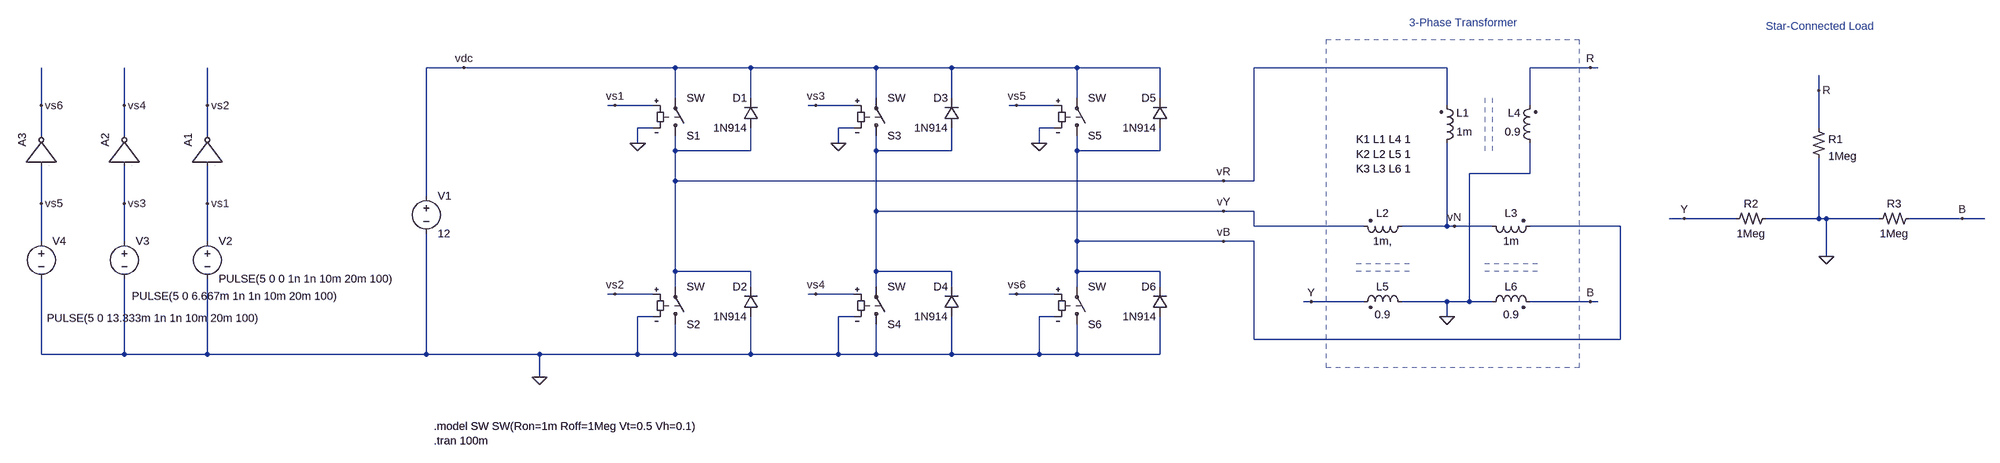
[diagram p0: schematic single-phase-inverter_v2p0.asc]
single-phase-inverter_v2p0.asc, the LTspice schematic file:
Version 4
SHEET 1 3380 860
WIRE -208 64 -288 64
WIRE 240 64 -208 64
WIRE 400 64 240 64
WIRE 704 64 400 64
WIRE 864 64 704 64
WIRE 1136 64 864 64
WIRE 1312 64 1136 64
WIRE 2032 64 1536 64
WIRE 2336 64 2208 64
WIRE 2352 64 2336 64
WIRE 2992 112 2992 80
WIRE 240 128 240 64
WIRE 400 128 400 64
WIRE 704 128 704 64
WIRE 864 128 864 64
WIRE 1136 128 1136 64
WIRE 1312 128 1312 64
WIRE -1104 144 -1104 64
WIRE -928 144 -928 64
WIRE -752 144 -752 64
WIRE 112 144 96 144
WIRE 192 144 112 144
WIRE 576 144 560 144
WIRE 656 144 576 144
WIRE 1008 144 992 144
WIRE 1088 144 1008 144
WIRE 2032 144 2032 64
WIRE 2208 144 2208 64
WIRE 192 192 160 192
WIRE 656 192 624 192
WIRE 1088 192 1056 192
WIRE 2992 192 2992 112
WIRE -1104 208 -1104 144
WIRE -928 208 -928 144
WIRE -752 208 -752 144
WIRE 160 224 160 192
WIRE 624 224 624 192
WIRE 1056 224 1056 192
WIRE 240 240 240 208
WIRE 400 240 400 192
WIRE 400 240 240 240
WIRE 704 240 704 208
WIRE 864 240 864 192
WIRE 864 240 704 240
WIRE 1136 240 1136 208
WIRE 1312 240 1312 192
WIRE 1312 240 1136 240
WIRE 2208 288 2208 224
WIRE 2208 288 2080 288
WIRE 240 304 240 240
WIRE 1472 304 240 304
WIRE 1536 304 1536 64
WIRE 1536 304 1472 304
WIRE -288 336 -288 64
WIRE -1104 352 -1104 272
WIRE -928 352 -928 272
WIRE -752 352 -752 272
WIRE 704 368 704 240
WIRE 1472 368 704 368
WIRE 1536 368 1472 368
WIRE 2672 384 2640 384
WIRE 2816 384 2672 384
WIRE 2992 384 2992 256
WIRE 2992 384 2880 384
WIRE 3008 384 2992 384
WIRE 3120 384 3008 384
WIRE 3296 384 3184 384
WIRE 3344 384 3296 384
WIRE 1536 400 1536 368
WIRE 1856 400 1536 400
WIRE 2032 400 2032 224
WIRE 2032 400 1936 400
WIRE 2048 400 2032 400
WIRE 2128 400 2048 400
WIRE 2400 400 2208 400
WIRE -1104 432 -1104 352
WIRE -928 432 -928 352
WIRE -752 432 -752 352
WIRE 1136 432 1136 240
WIRE 1472 432 1136 432
WIRE 1536 432 1472 432
WIRE 3008 464 3008 384
WIRE 240 496 240 304
WIRE 400 496 240 496
WIRE 704 496 704 368
WIRE 864 496 704 496
WIRE 1136 496 1136 432
WIRE 1312 496 1136 496
WIRE 240 528 240 496
WIRE 400 528 400 496
WIRE 704 528 704 496
WIRE 864 528 864 496
WIRE 1136 528 1136 496
WIRE 1312 528 1312 496
WIRE 112 544 96 544
WIRE 192 544 112 544
WIRE 576 544 560 544
WIRE 656 544 576 544
WIRE 1008 544 992 544
WIRE 1088 544 1008 544
WIRE 1744 560 1728 560
WIRE 1856 560 1744 560
WIRE 2032 560 1936 560
WIRE 2080 560 2080 288
WIRE 2080 560 2032 560
WIRE 2128 560 2080 560
WIRE 2336 560 2208 560
WIRE 2352 560 2336 560
WIRE 192 592 160 592
WIRE 656 592 624 592
WIRE 1088 592 1056 592
WIRE 2032 592 2032 560
WIRE 1536 640 1536 432
WIRE 2400 640 2400 400
WIRE 2400 640 1536 640
WIRE -1104 672 -1104 512
WIRE -928 672 -928 512
WIRE -928 672 -1104 672
WIRE -752 672 -752 512
WIRE -752 672 -928 672
WIRE -288 672 -288 416
WIRE -288 672 -752 672
WIRE -48 672 -288 672
WIRE 160 672 160 592
WIRE 160 672 -48 672
WIRE 240 672 240 608
WIRE 240 672 160 672
WIRE 400 672 400 592
WIRE 400 672 240 672
WIRE 624 672 624 592
WIRE 624 672 400 672
WIRE 704 672 704 608
WIRE 704 672 624 672
WIRE 864 672 864 592
WIRE 864 672 704 672
WIRE 1056 672 1056 592
WIRE 1056 672 864 672
WIRE 1136 672 1136 608
WIRE 1136 672 1056 672
WIRE 1312 672 1312 592
WIRE 1312 672 1136 672
WIRE -48 720 -48 672
FLAG 160 224 0
FLAG 624 224 0
FLAG 1056 224 0
FLAG -208 64 vdc
FLAG 112 144 vs1
FLAG 112 544 vs2
FLAG 576 144 vs3
FLAG 576 544 vs4
FLAG 1008 144 vs5
FLAG 1008 544 vs6
FLAG -752 352 vs1
FLAG -752 144 vs2
FLAG -928 352 vs3
FLAG -928 144 vs4
FLAG -1104 352 vs5
FLAG -1104 144 vs6
FLAG 1472 304 vR
FLAG 1472 368 vY
FLAG 1472 432 vB
FLAG -48 720 0
FLAG 2048 400 vN
FLAG 1744 560 Y
FLAG 2336 64 R
FLAG 2336 560 B
FLAG 3008 464 0
FLAG 2992 112 R
FLAG 2672 384 Y
FLAG 3296 384 B
FLAG 2032 592 0
SYMBOL sw 240 224 M180
SYMATTR InstName S1
SYMBOL sw 240 624 M180
SYMATTR InstName S2
SYMBOL sw 704 224 M180
SYMATTR InstName S3
SYMBOL sw 704 624 M180
SYMATTR InstName S4
SYMBOL sw 1136 224 M180
SYMATTR InstName S5
SYMBOL sw 1136 624 M180
SYMATTR InstName S6
SYMBOL voltage -288 320 R0
SYMATTR InstName V1
SYMATTR Value 12
SYMBOL voltage -752 416 R0
SYMATTR InstName V2
SYMATTR Value PULSE(5 0 0 1n 1n 10m 20m 100)
SYMBOL voltage -928 416 R0
WINDOW 3 16 132 Left 2
SYMATTR Value PULSE(5 0 6.667m 1n 1n 10m 20m 100)
SYMATTR InstName V3
SYMBOL voltage -1104 416 R0
WINDOW 3 12 179 Left 2
SYMATTR Value PULSE(5 0 13.333m 1n 1n 10m 20m 100)
SYMATTR InstName V4
SYMBOL diode 416 192 R180
WINDOW 0 24 64 Left 2
WINDOW 3 24 0 Left 2
SYMATTR InstName D1
SYMATTR Value 1N914
SYMBOL diode 416 592 R180
WINDOW 0 24 64 Left 2
WINDOW 3 24 0 Left 2
SYMATTR InstName D2
SYMATTR Value 1N914
SYMBOL diode 880 192 R180
WINDOW 0 24 64 Left 2
WINDOW 3 24 0 Left 2
SYMATTR InstName D3
SYMATTR Value 1N914
SYMBOL diode 880 592 R180
WINDOW 0 24 64 Left 2
WINDOW 3 24 0 Left 2
SYMATTR InstName D4
SYMATTR Value 1N914
SYMBOL diode 1328 192 R180
WINDOW 0 24 64 Left 2
WINDOW 3 24 0 Left 2
SYMATTR InstName D5
SYMATTR Value 1N914
SYMBOL diode 1328 592 R180
WINDOW 0 24 64 Left 2
WINDOW 3 24 0 Left 2
SYMATTR InstName D6
SYMATTR Value 1N914
SYMBOL Digital/inv -816 272 R270
SYMATTR InstName A1
SYMBOL Digital/inv -992 272 R270
SYMATTR InstName A2
SYMBOL Digital/inv -1168 272 R270
SYMATTR InstName A3
SYMATTR SpiceLine VHIGH=5
SYMBOL ind2 2016 240 M180
WINDOW 0 36 80 Left 2
WINDOW 3 36 40 Left 2
SYMATTR InstName L1
SYMATTR Value 1m
SYMATTR SpiceLine Rser=1m
SYMBOL ind2 1952 384 R90
WINDOW 0 4 56 VBottom 2
WINDOW 3 32 56 VTop 2
SYMATTR InstName L2
SYMATTR Value 1m,
SYMATTR SpiceLine Rser=1m
SYMBOL ind2 2112 384 M90
WINDOW 0 4 56 VBottom 2
WINDOW 3 32 56 VTop 2
SYMATTR InstName L3
SYMATTR Value 1m
SYMATTR SpiceLine Rser=1m
SYMBOL ind2 2224 240 R180
WINDOW 0 36 80 Left 2
WINDOW 3 36 40 Left 2
SYMATTR InstName L4
SYMATTR Value 0.9
SYMATTR SpiceLine Rser=1m
SYMBOL ind2 1952 576 M270
WINDOW 0 32 56 VTop 2
WINDOW 3 4 56 VBottom 2
SYMATTR InstName L5
SYMATTR Value 0.9
SYMATTR SpiceLine Rser=1m
SYMBOL ind2 2112 576 R270
WINDOW 0 32 56 VTop 2
WINDOW 3 4 56 VBottom 2
SYMATTR InstName L6
SYMATTR Value 0.9
SYMATTR SpiceLine Rser=1m
SYMBOL res2 2976 192 R0
SYMATTR InstName R1
SYMATTR Value 1Meg
SYMBOL res2 2816 400 R270
WINDOW 0 32 32 VTop 2
WINDOW 3 0 32 VBottom 2
SYMATTR InstName R2
SYMATTR Value 1Meg
SYMBOL res2 3184 368 R90
WINDOW 0 0 32 VBottom 2
WINDOW 3 32 32 VTop 2
SYMATTR InstName R3
SYMATTR Value 1Meg
TEXT -272 824 Left 2 !.model SW SW(Ron=1m Roff=1Meg Vt=0.5 Vh=0.1)\n.tran 100m
TEXT 1840 216 Left 2 !K1 L1 L4 1\nK2 L2 L5 1\nK3 L3 L6 1
TEXT 1952 -32 Left 2 ;3-Phase Transformer
TEXT 2880 -24 Left 2 ;Star-Connected Load
LINE Normal 2112 128 2112 240 2
LINE Normal 2128 128 2128 240 2
LINE Normal 2224 480 2112 480 2
LINE Normal 2224 496 2112 496 2
LINE Normal 1952 480 1840 480 2
LINE Normal 1952 496 1840 496 2
RECTANGLE Normal 1776 4 2312 700 2

The netlist it stands for:
* single-phase-inverter_v2p0.asc
S1 vR vdc vs1 0 SW
S2 0 vR vs2 0 SW
S3 vY vdc vs3 0 SW
S4 0 vY vs4 0 SW
S5 vB vdc vs5 0 SW
S6 0 vB vs6 0 SW
V1 vdc 0 12
V2 vs1 0 PULSE(5 0 0 1n 1n 10m 20m 100)
V3 vs3 0 PULSE(5 0 6.667m 1n 1n 10m 20m 100)
V4 vs5 0 PULSE(5 0 13.333m 1n 1n 10m 20m 100)
D1 vR vdc 1N914
D2 0 vR 1N914
D3 vY vdc 1N914
D4 0 vY 1N914
D5 vB vdc 1N914
D6 0 vB 1N914
A1 vs1 0 0 0 0 vs2 0 0 BUF
A2 vs3 0 0 0 0 vs4 0 0 BUF
A3 vs5 0 0 0 0 vs6 0 0 BUF VHIGH=5
L1 vN vR 1m Rser=1m
L2 vN vY 1m, Rser=1m
L3 vN vB 1m Rser=1m
L4 0 R 0.9 Rser=1m
L5 0 Y 0.9 Rser=1m
L6 0 B 0.9 Rser=1m
R1 R 0 1Meg
R2 Y 0 1Meg
R3 B 0 1Meg
.model D D
.lib standard.dio
.model SW SW(Ron=1m Roff=1Meg Vt=0.5 Vh=0.1)
.tran 100m
K1 L1 L4 1
K2 L2 L5 1
K3 L3 L6 1
* 3-Phase Transformer
* Star-Connected Load
.backanno
.end